# Altium schematic sheet C-08 eMMC.SchDoc
size 513 x 386 mm; Address1: 350W 9th Ave; Address2: Suite 206; Address3: Escondido CA 92025; Address4: United States; Revision: -; ENG_APP_DATE: --/--/--; DSN_APP_DATE: --/--/--; CHK_APP_DATE: --/--/--
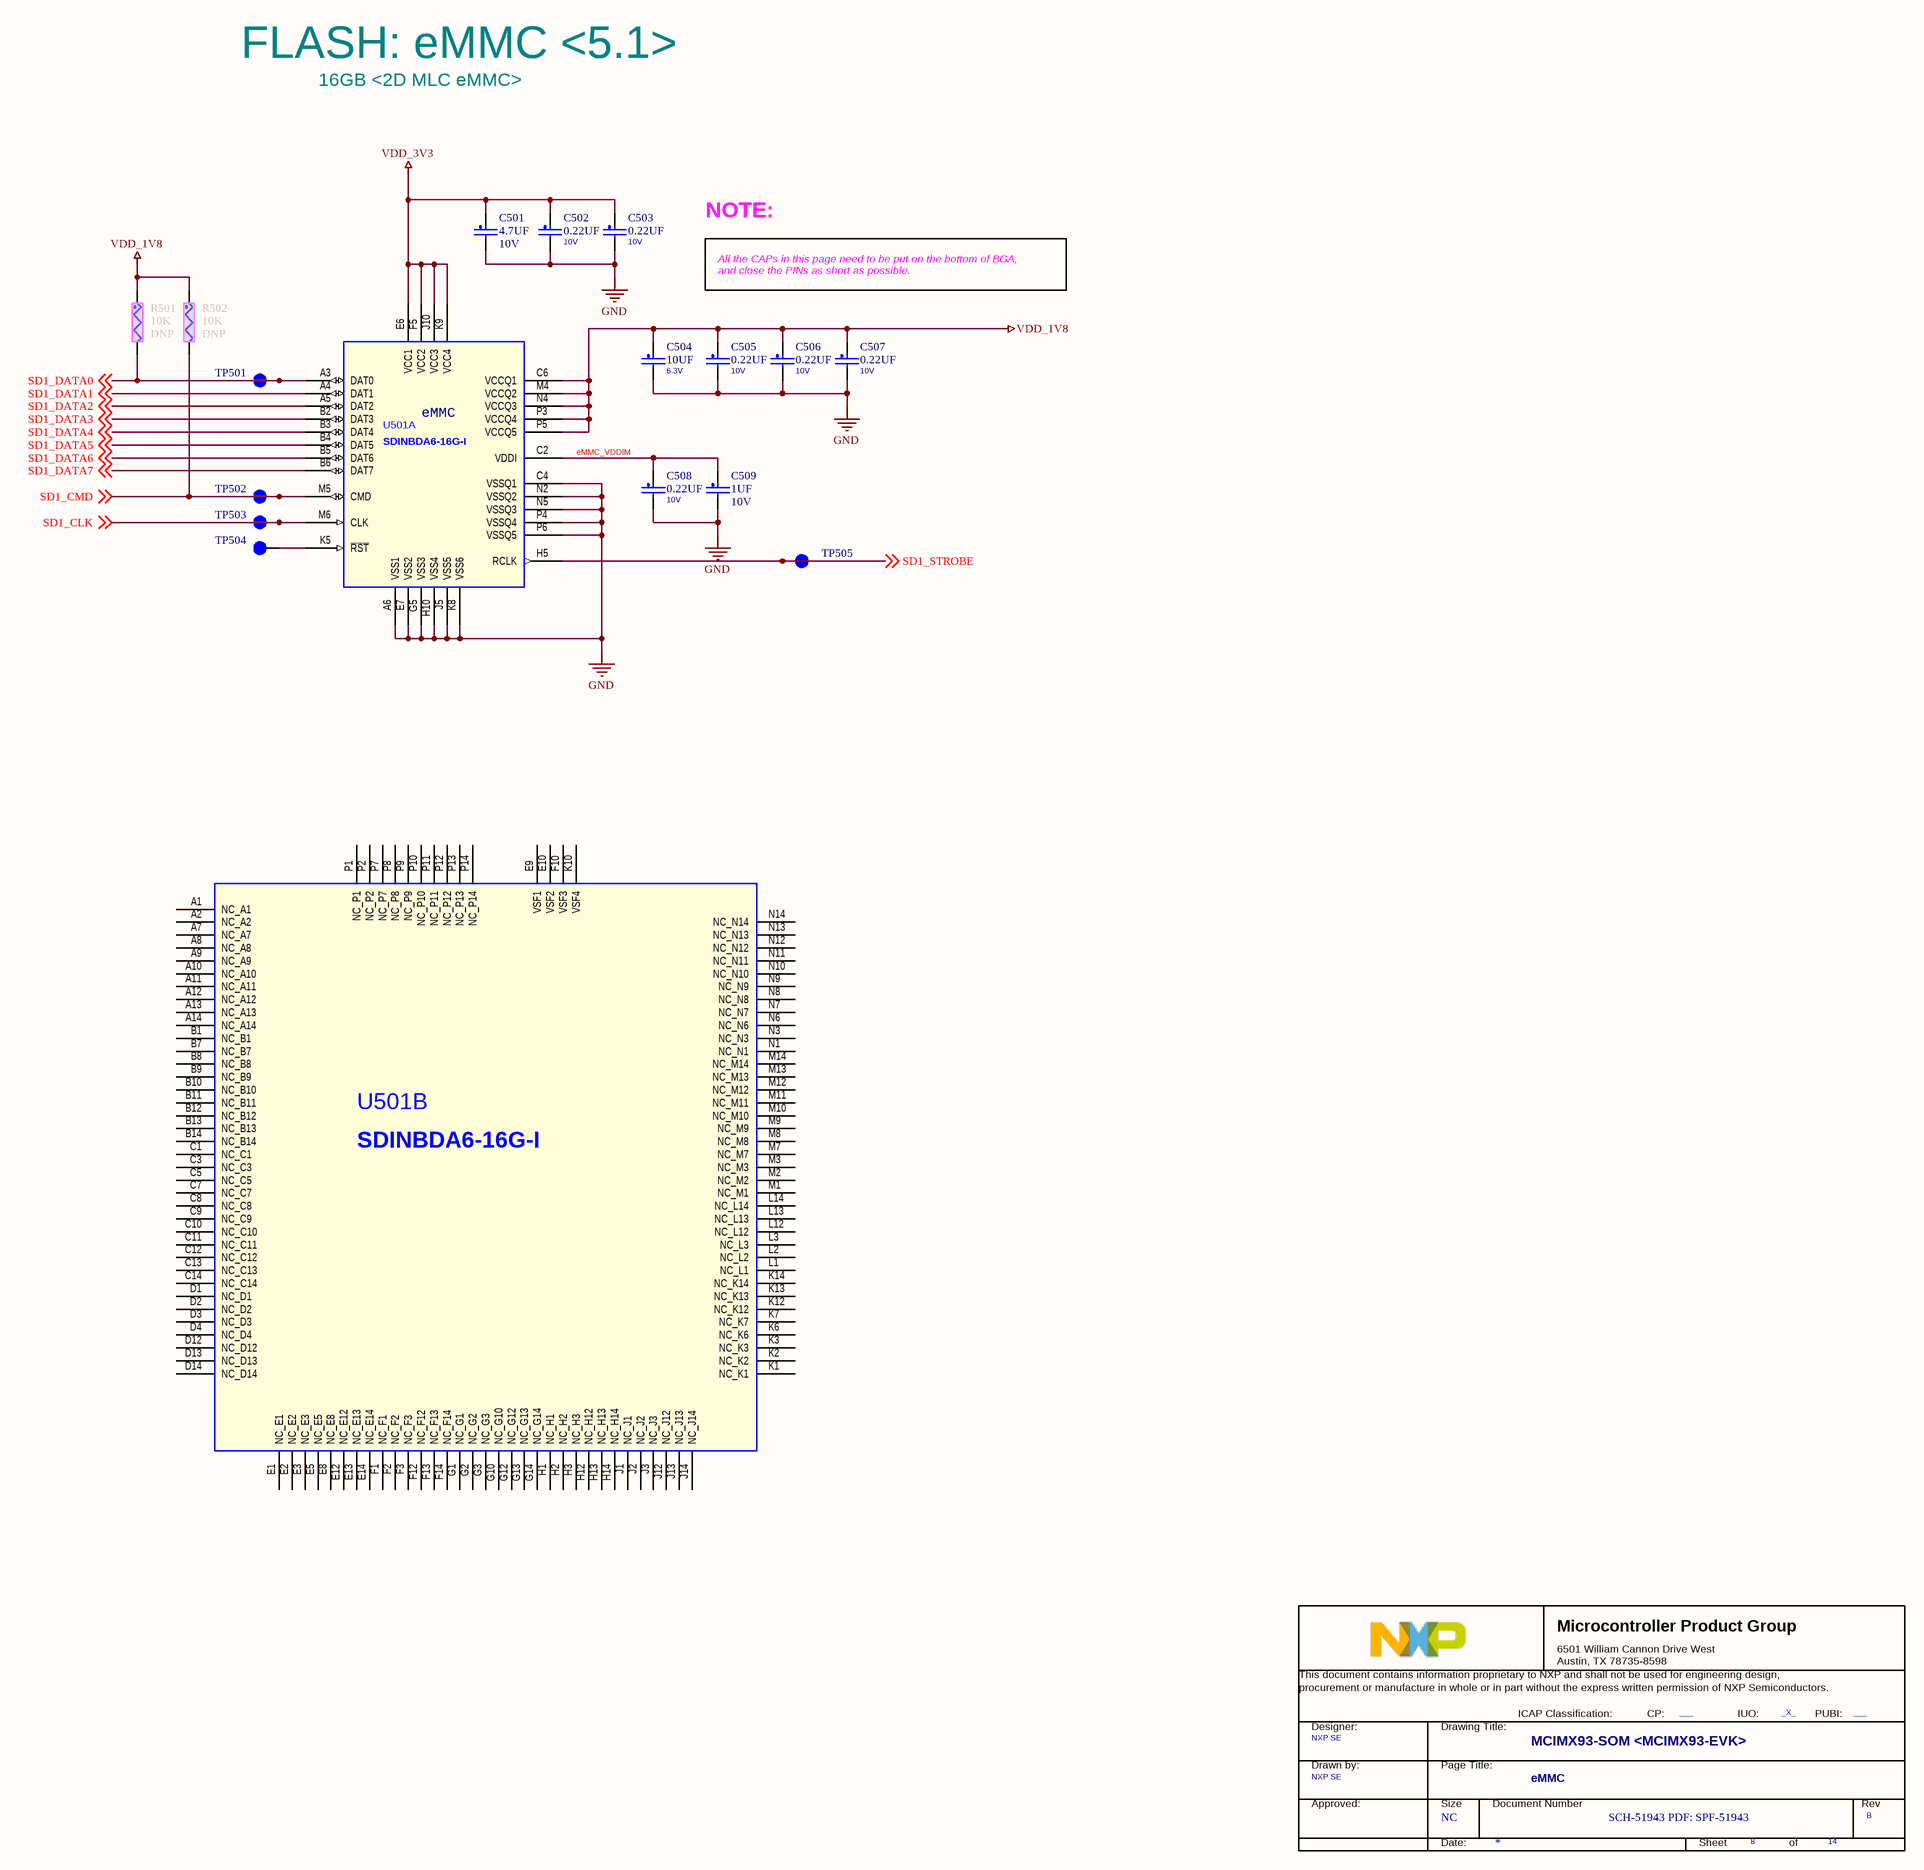
[diagram p0: C-08 eMMC.SchDoc]

## Parts
*  Doc: SCH-51943 PDF: SPF-51943  RevCode: B  Title: MCIMX93-SOM <MCIMX93-EVK>  Page Size: NC  Page Number: 8  Page Count: 14  PageTitle: eMMC  Designer: NXP SE  PUBI: ___  FIUO: _X_  (hidden comment: TitleBlock_MCPG)  (graphical)
C501  4.7UF  VOLTAGE: 10V  [cc0402_tol0p15]
C502  0.22UF  VOLTAGE: 10V  [0201_CC]
C503  0.22UF  VOLTAGE: 10V  [0201_CC]
C504  10UF  VOLTAGE: 6.3V  [0402_CC]
C505  0.22UF  VOLTAGE: 10V  [0201_CC]
C506  0.22UF  VOLTAGE: 10V  [0201_CC]
C507  0.22UF  VOLTAGE: 10V  [0201_CC]
C508  0.22UF  VOLTAGE: 10V  [0201_CC]
C509  1UF  VOLTAGE: 10V  [0201_CC]
R501  10K  ASSY_OPT: DNP  [0402_CC]
R502  10K  ASSY_OPT: DNP  [0402_CC]
TP501  tpad_020  [tpad_020]  (value not drawn)  (no BOM)
TP502  tpad_020  [tpad_020]  (value not drawn)  (no BOM)
TP503  tpad_020  [tpad_020]  (value not drawn)  (no BOM)
TP504  TPAD_015  [TPAD_015]  (value not drawn)  (no BOM)
TP505  tpad_020  [tpad_020]  (value not drawn)  (no BOM)
U501  SDINBDA6-16G-I  [fbga153_0p5_11p5x13]  (parts A,B of 2)

## Nets
GND: C501.2 C502.2 C503.2 C504.2 C505.2 C506.2 C507.2 C508.2 C509.2 U501.A6(VSS1) U501.C4(VSSQ1) U501.E7(VSS2) U501.G5(VSS3) U501.H10(VSS4) U501.J5(VSS5) U501.K8(VSS6) U501.N2(VSSQ2) U501.N5(VSSQ3) U501.P4(VSSQ4) U501.P6(VSSQ5)
VDD_1V8: C504.1 C505.1 C506.1 C507.1 R501.1 R502.1 U501.C6(VCCQ1) U501.M4(VCCQ2) U501.N4(VCCQ3) U501.P3(VCCQ4) U501.P5(VCCQ5)
VDD_3V3: C501.1 C502.1 C503.1 U501.E6(VCC1) U501.F5(VCC2) U501.J10(VCC3) U501.K9(VCC4)
eMMC_VDDIM: C508.1 C509.1 U501.C2(VDDI)
SD1_CLK: TP503.1(Pin1) U501.M6(CLK) ; off-sheet SD1_CLK
SD1_CMD: R502.2 TP502.1(Pin1) U501.M5(CMD) ; off-sheet SD1_CMD
SD1_DATA0: R501.2 TP501.1(Pin1) U501.A3(DAT0) ; off-sheet SD1_DATA0
SD1_DATA1: U501.A4(DAT1) ; off-sheet SD1_DATA1
SD1_DATA2: U501.A5(DAT2) ; off-sheet SD1_DATA2
SD1_DATA3: U501.B2(DAT3) ; off-sheet SD1_DATA3
SD1_DATA4: U501.B3(DAT4) ; off-sheet SD1_DATA4
SD1_DATA5: U501.B4(DAT5) ; off-sheet SD1_DATA5
SD1_DATA6: U501.B5(DAT6) ; off-sheet SD1_DATA6
SD1_DATA7: U501.B6(DAT7) ; off-sheet SD1_DATA7
SD1_STROBE: TP505.1(Pin1) U501.H5(RCLK) ; off-sheet SD1_STROBE
NetTP504_1: TP504.1(Pin1) U501.K5(~{RST})

Not connected (* = marked no-connect by the designer): U501 A1(NC_A1) A2(NC_A2) A7(NC_A7) A8(NC_A8) A9(NC_A9) A10(NC_A10) A11(NC_A11) A12(NC_A12) A13(NC_A13) A14(NC_A14) B1(NC_B1) B7(NC_B7) B8(NC_B8) B9(NC_B9) B10(NC_B10) B11(NC_B11) B12(NC_B12) B13(NC_B13) B14(NC_B14) C1(NC_C1) C3(NC_C3) C5(NC_C5) C7(NC_C7) C8(NC_C8) C9(NC_C9) C10(NC_C10) C11(NC_C11) C12(NC_C12) C13(NC_C13) C14(NC_C14) D1(NC_D1) D2(NC_D2) D3(NC_D3) D4(NC_D4) D12(NC_D12) D13(NC_D13) D14(NC_D14) E1(NC_E1) E2(NC_E2) E3(NC_E3) E5(NC_E5) E8(NC_E8) E9(VSF1) E10(VSF2) E12(NC_E12) E13(NC_E13) E14(NC_E14) F1(NC_F1) F2(NC_F2) F3(NC_F3) F10(VSF3) F12(NC_F12) F13(NC_F13) F14(NC_F14) G1(NC_G1) G2(NC_G2) G3(NC_G3) G10(NC_G10) G12(NC_G12) G13(NC_G13) G14(NC_G14) H1(NC_H1) H2(NC_H2) H3(NC_H3) H12(NC_H12) H13(NC_H13) H14(NC_H14) J1(NC_J1) J2(NC_J2) J3(NC_J3) J12(NC_J12) J13(NC_J13) J14(NC_J14) K1(NC_K1) K2(NC_K2) K3(NC_K3) K6(NC_K6) K7(NC_K7) K10(VSF4) K12(NC_K12) K13(NC_K13) K14(NC_K14) L1(NC_L1) L2(NC_L2) L3(NC_L3) L12(NC_L12) L13(NC_L13) L14(NC_L14) M1(NC_M1) M2(NC_M2) M3(NC_M3) M7(NC_M7) M8(NC_M8) M9(NC_M9) M10(NC_M10) M11(NC_M11) M12(NC_M12) M13(NC_M13) M14(NC_M14) N1(NC_N1) N3(NC_N3) N6(NC_N6) N7(NC_N7) N8(NC_N8) N9(NC_N9) N10(NC_N10) N11(NC_N11) N12(NC_N12) N13(NC_N13) N14(NC_N14) P1(NC_P1) P2(NC_P2) P7(NC_P7) P8(NC_P8) P9(NC_P9) P10(NC_P10) P11(NC_P11) P12(NC_P12) P13(NC_P13) P14(NC_P14)

## Notes on the sheet
- FLASH: eMMC <5.1>
- 16GB <2D MLC eMMC>
- NOTE:
- All the CAPs in this page need to be put on the bottom of BGA,
  and close the PINs as short as possible.
- 8
- 7
- 6
- 5
- 4
- 3
- 2
- 1
- REVISION
- DESCRIPTION
- DATE
- APPROVED
- F
- E
- D
- C
- B
- PROJECT:
- REV.
- ENG:
- APPROVALS
- PROJECT
- JordanDSP LLC <https://www.jordandsp.com>
- Envision Excellence
- SHT.
- A
- DSN:
- CHK:
- REFERENCE ITEMS
- PRJ VCS REVISION:
- TITLE
- DOC VCS REVISION:
- MODIFIED DATE:
- BOM:
- FAB DWG:
- FIRMWARE:
- ASSY DWG:
- SCALE:
- SIZE
- CAGE CODE
- FILE NAME
- DWG NO.
- PAGE
- PRODUCT REV
- OF
- (in symbol SDINBDA6_32G_I_VFBGA_153P, part A) eMMC
- (in symbol TitleBlock_MCPG) Microcontroller Product Group; 6501 William Cannon Drive West / Austin, TX 78735-8598; This document contains information proprietary to NXP and shall not be used for engineering design,; procurement or manufacture in whole or in part without the express written permission of NXP Semiconductors.; ICAP Classification:; CP:; IUO:; PUBI:; Designer:; Drawing Title:; Drawn by:; Page Title:; Approved:; Size; Document Number; Rev; Date:; Sheet; of

## Library data of the parts
* = TitleBlock_MCPG: OrgName: NXP Semiconductor; OrgAddr1: NO. 192 Liangjing Rd. Pudong New Area, ShangHai; Page Create Date: March  8, 1995; DrawnBy: NXP SE; FCP: ___; Page Modify Date: *
C501 = CAP_NP: CAP CER 4.7uF 10V 10% X5R 0402; CLASS: DISCRETE; AGILE_PN: 150-80044; MFG_NAME01: SAMSUNG ELECTRO MECHANICS; MFG_PN01: CL05A475KP5NRNC; CAD_APPROVED: Yes; FPLIST: cc0402_tol0p15,cc0402_tol0p15_ov,0402_cc_nsp; 3D_Mechanical_Footprint_File: cc0402_tol0p15; PCB Footprint: cc0402_tol0p15; Tolerance: 10%; ROHS: Yes; HEIGHT: 0.65MM
C502 C507 C508 = CAP_NP: CAP CER 0.22UF 10V 20% X5R 0201; CLASS: DISCRETE; AGILE_PN: 150-78815; MFG_NAME01: Taiyo Yuden; MFG_PN01: LMK063BJ224MP-F; CAD_APPROVED: Yes; FPLIST: CC0201,CC0201_HD,0201_CC; PCB Footprint: 0201_CC; Tolerance: 20%; ROHS: Yes; HEIGHT: 0.33MM
C503 C505 C506 = CAP_NP: CAP CER 0.22UF 10V 20% X5R 0201; CLASS: DISCRETE; FPLIST: CC0201,CC0201_HD,0201_CC; CAD_APPROVED: Yes; MFG_PN01: LMK063BJ224MP-F; MFG_NAME01: Taiyo Yuden; AGILE_PN: 150-78815; PCB Footprint: 0201_CC; HEIGHT: 0.33MM; ROHS: Yes; Tolerance: 20%
C504 = CAP_NP: CAP CER 10UF 6.3V 20% X5R 0402; CLASS: DISCRETE; FPLIST: CC0402_25,CC0402_HD,0402_CC; CAD_APPROVED: Yes; MFG_PN01: CL05A106MQ5NUNC; MFG_NAME01: SAMSUNG ELECTRO MECHANICS; AGILE_PN: 150-79163; PCB Footprint: 0402_CC; HEIGHT: 0.65 MM; ROHS: Yes; Tolerance: 20%
C509 = CAP_NP: CAP CER 1.0uF 10V 10% X5R 0201; CLASS: DISCRETE; AGILE_PN: 150-81088; MFG_NAME01: SAMSUNG ELECTRO MECHANICS; MFG_PN01: CL03A105KP3NSNC; CAD_APPROVED: Yes; FPLIST: CC0201,CC0201_HD,0201_CC,cc_0201_cir; Temp Range: -55¡ãC to 85¡ãC; PCB Footprint: 0201_CC; Package Type: SMD/SMT; Package Size: 0201 (0603 Metric); Tolerance: 10%; ROHS: Yes; HEIGHT: 0.35MM
R501 = RES: RES MF 10K 1/16W 5% 0402; CLASS: DISCRETE; AGILE_PN: 470-75557; MFG_NAME01: VISHAY INTERTECHNOLOGY; MFG_PN01: CRCW040210K0JNED; CAD_APPROVED: Yes; FPLIST: RC0402_25,RC0402_HD,0402_CC; Tolerance: 5%; ROHS: Yes; HEIGHT: 0.4 MM; PCB Footprint: 0402_CC
R502 = RES: RES MF 10K 1/16W 5% 0402; CLASS: DISCRETE; FPLIST: RC0402_25,RC0402_HD,0402_CC; CAD_APPROVED: Yes; MFG_PN01: CRCW040210K0JNED; MFG_NAME01: VISHAY INTERTECHNOLOGY; AGILE_PN: 470-75557; HEIGHT: 0.4 MM; ROHS: Yes; Tolerance: 5%; PCB Footprint: 0402_CC
TP501 = TESTLOOP: TEST POINT PAD 0.5MM DIA SMT, NO PART TO ORDER; ASSY_OPT: DNP; CLASS: IO; CAD_APPROVED: Yes; AGILE_PN: 211-77484; PCB Footprint: tpad_020; HEIGHT: 0.1MM; ROHS: Yes
TP502 TP503 TP505 = TESTLOOP: TEST POINT PAD 0.5MM DIA SMT, NO PART TO ORDER; ASSY_OPT: DNP; CLASS: IO; AGILE_PN: 211-77484; CAD_APPROVED: Yes; PCB Footprint: tpad_020; ROHS: Yes; HEIGHT: 0.1MM
TP504 = TESTLOOP: TEST POINT PAD 15MIL DIA SMT, NO PART TO ORDER; ASSY_OPT: DNP; CLASS: IO; CAD_APPROVED: Yes; MFG_PN01: NOTACOMPONENT; AGILE_PN: 211-76645; PCB Footprint: TPAD_015; HEIGHT: 0.1MM; ROHS: Yes; MFG_NAME01: NOTACOMPONENT
U501 = SDINBDA6_32G_I_VFBGA_153P: IC MEM NAND FLASH 16GB MMC 5.1 CTLR 2.7-3.6V FBGA153; MFG_NAME01: SANDISK CORPORATION; Temp Range: -25¡ãC to 85¡ãC; CAD_APPROVED: Yes; AGILE_PN: 342-00870; CLASS: IC; PCB Footprint: fbga153_0p5_11p5x13; MFG_PN01: SDINBDA6-16G-I; ROHS: Yes; HEIGHT: 1MM